# Altium schematic sheet Sch_Buzzer.SchDoc: Control de Domótica
size A4; Author: Francisco González González - Eugenia Ipar; CompanyName: Botones, LEDs y Buzzer; Organization: Altium Limited; Address1: L3, 12a Rodborough Rd; Address2: Frenchs Forest; Address3: NSW; Address4: Australia 2086; DocumentNumber: 4; SheetNumber: 4; SheetTotal: 12; Materia: Técnicas Digitales II; Placa: Buzzer y Botones; Year: 2015; Prof1: Prof: Alarcón, Juan; Prof2: Ayud: Crivelli, Marcelo; Prof3: Ayud: Montalti, Pablo; PageSetup: Record=PageOptions|CenterHorizontal=True|CenterVertical=True|PrintScale=1.00|XCorrection=1.00|YCorrection=1.00|PrintKind=0|BorderSize=5000000|LeftOffset=0|BottomOffset=0|Orientation=2|PaperLength=1000|PaperWidth=1000|Scale=100|PaperSource=7|PrintQuality=-3|MediaType=1|DitherType=10|PrintScaleMode=1|PaperKind=A4|PaperIndex=9
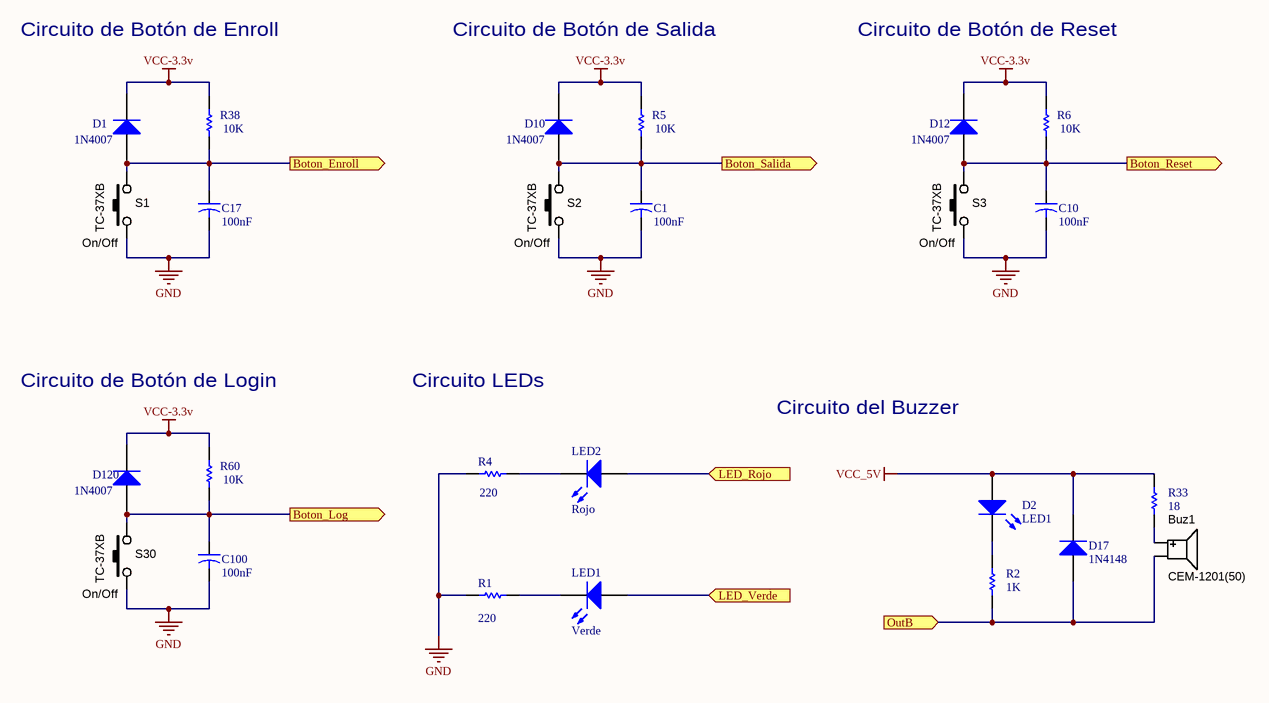
[diagram p0: Sch_Buzzer.SchDoc]

## Parts
Buz1  Manufacturer Part Number 1: CEM-1201(50)  [BUZZER_12.0X8.5MM]  (hidden comment: Alternate part: 3100-932)
C1  value 100nF  [CAPR5-4X5]  (hidden comment: Cap2)
C10  value 100nF  [CAPR5-4X5]  (hidden comment: Cap2)
C17  value 100nF  [CAPR5-4X5]  (hidden comment: Cap2)
C100  value 100nF  [CAPR5-4X5]  (hidden comment: Cap2)
D1  1N4007  [DO-41]
D2  LED1  [Type 3mm]
D10  1N4007  [DO-41]
D12  1N4007  [DO-41]
D17  1N4148  [DO-35]
D120  1N4007  [DO-41]
LED1  Verde  [Type 5mm]
LED2  Rojo  [Type 5mm]
R1  value 220  [AXIAL-0.3]  (hidden comment: Res1)
R2  value 1K  [AXIAL-0.3]  (hidden comment: Res1)
R4  value 220  [AXIAL-0.3]  (hidden comment: Res1)
R5  value 10K  [AXIAL-0.3]  (hidden comment: Res1)
R6  value 10K  [AXIAL-0.3]  (hidden comment: Res1)
R33  value 18  [AXIAL-0.3]  (hidden comment: Res1)
R38  value 10K  [AXIAL-0.3]  (hidden comment: Res1)
R60  value 10K  [AXIAL-0.3]  (hidden comment: Res1)
S1  Manufacturer Part Number 1: TC-37XB  Function: On/Off  [TACT-SWITCH-TC-37XB]  (hidden comment: SW_THT_PB_5.0mm)
S2  Manufacturer Part Number 1: TC-37XB  Function: On/Off  [TACT-SWITCH-TC-37XB]  (hidden comment: SW_THT_PB_5.0mm)
S3  Manufacturer Part Number 1: TC-37XB  Function: On/Off  [TACT-SWITCH-TC-37XB]  (hidden comment: SW_THT_PB_5.0mm)
S30  Manufacturer Part Number 1: TC-37XB  Function: On/Off  [TACT-SWITCH-TC-37XB]  (hidden comment: SW_THT_PB_5.0mm)

## Ports
Boton_Enroll (out), Boton_Log (out), Boton_Reset (out), Boton_Salida (out), LED_Rojo (in), LED_Verde (in), OutB (in)

## Nets
GND: C1.2 C10.2 C17.2 C100.2 R1.1 R4.1 S1.1 S2.1 S3.1 S30.1
VCC-3.3v: D1.2(K) D10.2(K) D12.2(K) D120.2(K) R5.2 R6.2 R38.2 R60.2
VCC_5V: D2.2(A) D17.2(K) R33.2
Boton_Enroll: C17.1 D1.1(A) R38.1 S1.2 ; port Boton_Enroll
Boton_Log: C100.1 D120.1(A) R60.1 S30.2 ; port Boton_Log
Boton_Reset: C10.1 D12.1(A) R6.1 S3.2 ; port Boton_Reset
Boton_Salida: C1.1 D10.1(A) R5.1 S2.2 ; port Boton_Salida
LED_Rojo: LED2.2(A) ; port LED_Rojo
LED_Verde: LED1.2(A) ; port LED_Verde
OutB: Buz1.2(Negative) D17.1(A) R2.1 ; port OutB
NetBuz1_1: Buz1.1(Positive) R33.1
NetD2_1: D2.1(K) R2.2
NetLED1_1: LED1.1(K) R1.2
NetLED2_1: LED2.1(K) R4.2

## Notes on the sheet
- Circuito de Botón de Enroll
- Circuito de Botón de Salida
- Circuito de Botón de Reset
- Circuito de Botón de Login
- Circuito LEDs
- Circuito del Buzzer
- Sheet
- of

## Library data of the parts
Buz1 = BZ_12x8.5x6.5_2kHz: Speaker, Magnetic Transducer; Manufacturer 1: CUI Inc; Ratings: 2048 ±200 Hz; SCDType: source; Package / Case: 6.5mm pitch; Material: Noryl SE1-J; Supplier 1: Digi-Key; Supplier Part Number 1: 102-1152-ND
C1 C10 C17 C100 = Cap2: Capacitor; Published: 23-Sep-2002; PackageReference: CAPR5-4X5; Publisher: Altium Limited; PackageDescription: Capacitor; 2 Leads
D1 D10 D12 D120 = Diode 1N4007: 1 Amp General Purpose Rectifier; Published: 8-Jun-2000; LatestRevisionDate: 17-Jul-2002; LatestRevisionNote: Re-released for DXP Platform.; DatasheetVersion: 1998; PackageVersion: Aug-1999; PackageReference: DO-41; Publisher: Altium Limited; PackageDescription: Diode, Axial; Body 5.2 x 2.7 mm (LxDia. max), Lead Dia. 0.86 mm (max); Code_JEDEC: DO-204-AL; ComponentLink1Description: Manufacturer Link; ComponentLink1URL: http://www.fairchildsemi.com/; ComponentLink2Description: Datasheet; ComponentLink2URL: http://www.fairchildsemi.com/ds/1N%2F1N4001.pdf
D2 = CMP-1488-00002-1: THT LED round mono-color color lens, WL-TMRW, Super Red; PartNumber: 151031SS06000; Manufacturer: Wuerth Elektronik; ComponentLink2URL: http://katalog.we-online.de/pbs/datasheet/7448042001.pdfhttp://katalog.we-online.de/pbs/datasheet/7448042001.pdfhttp://katalog.we-online.de/pbs/datasheet/7448042001.pdfhttp://katalog.we-online.de/pbs/datasheet/151031SS06000.pdf; ComponentLink1URL: http://www.we-online.com; ComponentLink2Description: Datasheet; PackageReference: Type 3mm; Emitting color: Super Red; ComponentLink1Description: Manufacturer URL
D17 = Diode 1N4148: High Conductance Fast Diode; Published: 8-Jun-2000; LatestRevisionDate: 17-Jul-2002; LatestRevisionNote: Re-released for DXP Platform.; DatasheetVersion: 1997; PackageReference: DO-35; Publisher: Altium Limited; PackageDescription: Diode, Axial; Body 3.8 x 1.9 mm (LxDia. max), Lead Dia. 0.53 mm (max); Code_JEDEC: DO-204-AH; ComponentLink1Description: Manufacturer Link; ComponentLink1URL: http://www.fairchildsemi.com/; ComponentLink2Description: Datasheet; ComponentLink2URL: http://www.fairchildsemi.com/ds/1N%2F1N4148.pdf
LED1 = CMP-1489-00005-1: THT LED round mono-color waterclear, WL-TMRW, Green; PartNumber: 151053GS03000; Manufacturer: Wuerth Elektronik; ComponentLink2URL: http://katalog.we-online.de/pbs/datasheet/7448042001.pdfhttp://katalog.we-online.de/pbs/datasheet/7448042001.pdfhttp://katalog.we-online.de/pbs/datasheet/7448042001.pdfhttp://katalog.we-online.de/pbs/datasheet/151053GS03000.pdf; ComponentLink2Description: Datasheet; ComponentLink1URL: http://www.we-online.com; PackageReference: Type 5mm; ComponentLink1Description: Manufacturer URL; Emitting color: Green
LED2 = CMP-1488-00008-1: THT LED round mono-color color lens, WL-TMRW, Red; PartNumber: 151051RS11000; Manufacturer: Wuerth Elektronik; PackageReference: Type 5mm; ComponentLink2URL: http://katalog.we-online.de/pbs/datasheet/7448042001.pdfhttp://katalog.we-online.de/pbs/datasheet/7448042001.pdfhttp://katalog.we-online.de/pbs/datasheet/7448042001.pdfhttp://katalog.we-online.de/pbs/datasheet/151051RS11000.pdf; ComponentLink1URL: http://www.we-online.com; ComponentLink1Description: Manufacturer URL; ComponentLink2Description: Datasheet; Emitting color: Red
R1 R2 R4-R6 R33 R38 R60 = Res1: Resistor; Published: 8-Jun-2000; LatestRevisionDate: 17-Jul-2002; LatestRevisionNote: Re-released for DXP Platform.; PackageReference: AXIAL-0.3; Publisher: Altium Limited; PackageDescription: Axial Device, Thru-Hole; 2 Leads; 0.3 in Pin Spacing
S1-S3 S30 = SW_THT_PB_5.0mm: Switch, tact, 5.0mm stem; Manufacturer 1: Wealth Metal; SCDType: spec; Package / Case: 6.5x6.5mm; 5.0mm stem; Material: Brass/Nylon/Ag plating